# EAGLE design 555-ADSR-Rene-Schmitz (EAGLE 7.2.0)
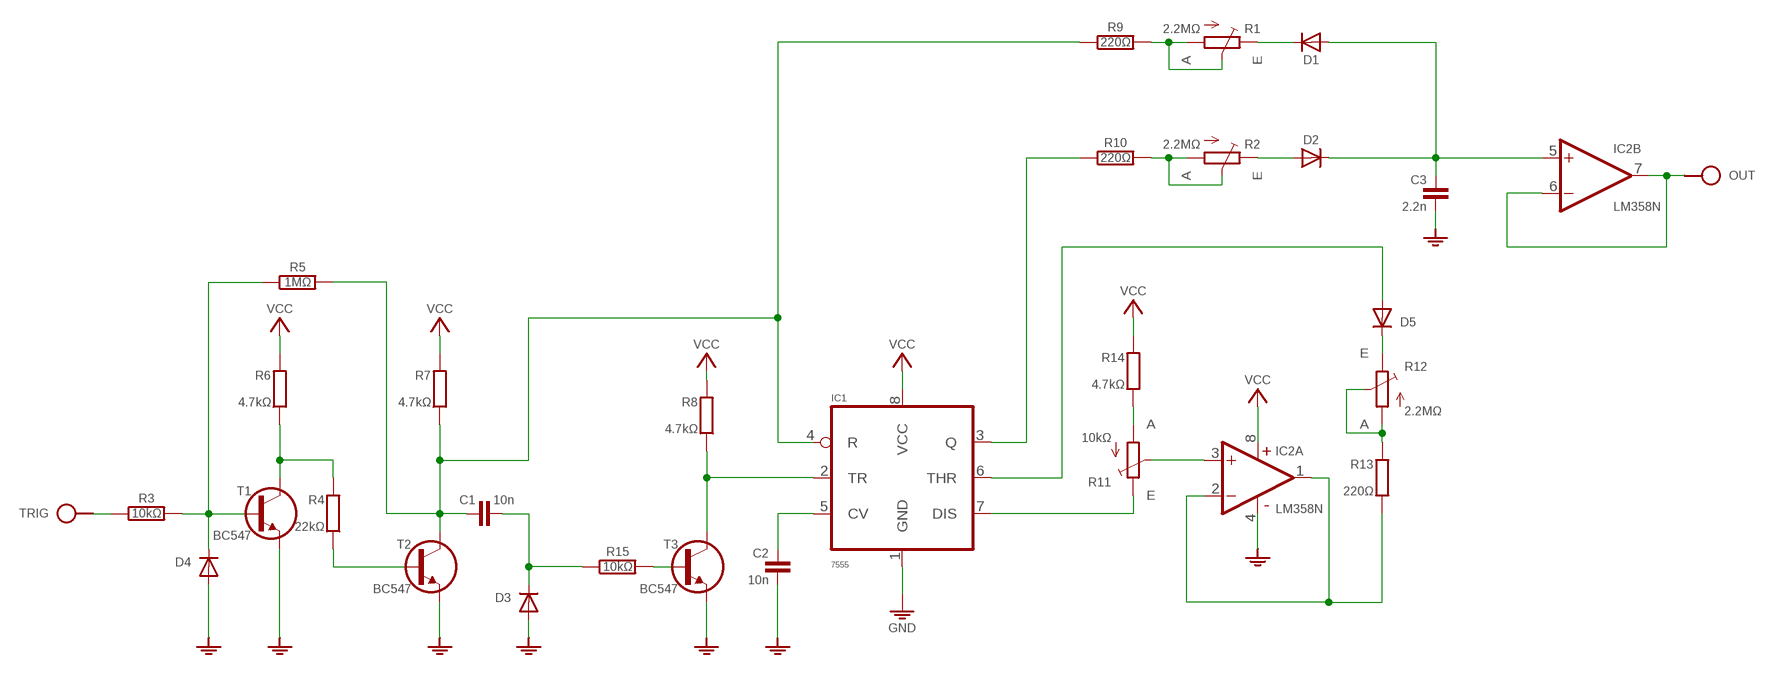
[diagram p0: schematic, sheet 1]

## Parts
C1  10n  C-H050-020X044  [C050-020X044]
C2  10n  C050-025X075/V  [C050-025X075/V]
C3  2.2n  C050-025X075/V  [C050-025X075/V]
D1  DIODE-HDO34-7  [DO34-7]
D2  DIODE-HDO34-7  [DO34-7]
D3  DIODE34-7V  [DO34-7V]
D4  DIODE34-7V  [DO34-7V]
D5  DIODE34-7V  [DO34-7V]
IC1  7555  [DIL08]
IC2  LM358N  [DIL08]
OUT  SPAD  [SPAD]
R1  2.2MΩ  TRIMR-TRIM  [R-TRIM]
R2  2.2MΩ  TRIMR-TRIM  [R-TRIM]
R3  10kΩ  R-H0204/10  [0204/10]
R4  22kΩ  R0204/10-V  [0204/10-V]
R5  1MΩ  R-H0204/10  [0204/10]
R6  4.7kΩ  R0204/10  [0204/10]
R7  4.7kΩ  R0204/10  [0204/10]
R8  4.7kΩ  R0204/10  [0204/10]
R9  220Ω  R-H0204/10  [0204/10]
R10  220Ω  R-H0204/10  [0204/10]
R11  10kΩ  TRIMR-TRIM  [R-TRIM]
R12  2.2MΩ  TRIMR-TRIM  [R-TRIM]
R13  220Ω  R0204/10-V  [0204/10-V]
R14  4.7kΩ  R0204/10  [0204/10]
R15  10kΩ  R-H0204/10  [0204/10]
S2  VCC_GNDL  [SPAD-+]
T1  BC547  [TO92-CBE]
T2  BC547  [TO92-CBE]
T3  BC547  [TO92-CBE]
TRIG  SPAD  [SPAD]

## Nets
GND: C2.2 C3.2 D3.A D4.A IC1.1(GND) IC2.4(P:V-) S2.1 T1.E T2.E T3.E
N$1: R4.1 R6.2 T1.C
N$2: R4.2 T2.B
N$3: IC2.3(A:+IN) R11.2(S)
N$4: D4.C R3.2 R5.1 T1.B
N$5: R15.2 T3.B
N$6: R1.1(A) R1.2(S) R9.2
N$7: R2.1(A) R2.2(S) R10.2
N$8: R3.1 TRIG.1
N$9: C1.1 IC1.4(R) R5.2 R7.2 R9.1 T2.C
N$10: IC1.2(TR) R8.2 T3.C
N$11: IC2.6(B:-IN) IC2.7(B:OUT) OUT.1
N$12: C2.1 IC1.5(CV)
N$13: R12.1(A) R12.2(S) R13.1
N$14: R11.1(A) R14.2
N$15: IC1.7(DIS) R11.3(E)
N$16: D5.A IC1.6(THR)
N$17: D5.C R12.3(E)
N$18: C1.2 D3.C R15.1
N$19: IC1.3(Q) R10.1
N$20: D2.A R2.3(E)
N$21: D1.C R1.3(E)
N$22: IC2.1(A:OUT) IC2.2(A:-IN) R13.2
N$23: C3.1 D1.A D2.C IC2.5(B:+IN)
VCC: IC1.8(VCC) IC2.8(P:V+) R6.1 R7.1 R8.1 R14.1 S2.2

## Library data of the parts
C1 = c:C-H
C2 C3 = c:C: CAPACITOR, European symbol
D1 D2 = d:DIODE-H
D3-D5 = d:DIODE
IC1 = ic:7555
IC2 = ic:LM358: OP AMP also LM158; LM258; LM2904 Source: http://cache.national.com/ds/LM/LM158.pdf
OUT TRIG = pad:SPAD
R1 R2 R11 R12 = r:TRIM: POTENTIOMETER
R3 R5 R9 R10 R15 = r:R-H
R4 R6-R8 R13 R14 = r:R: RESISTOR, European symbol
S2 = pad:VCC_GND
T1-T3 = t:BC547

## Net classes
0 default: width 1.27 mm

## Board
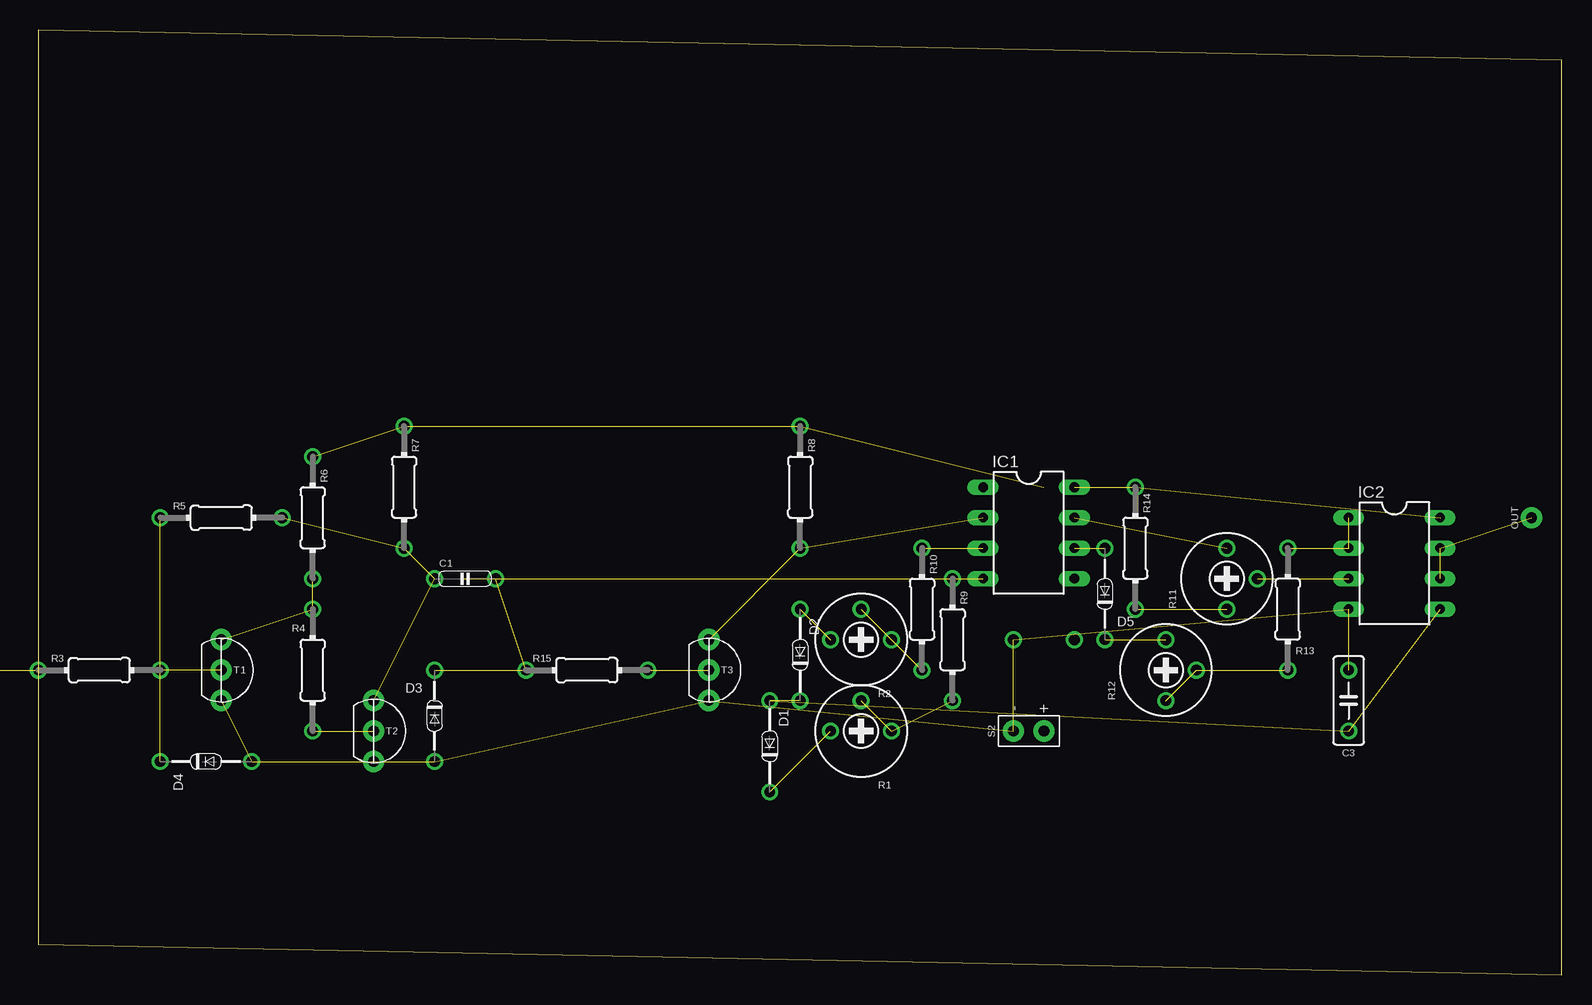
[diagram p1: board, top side]
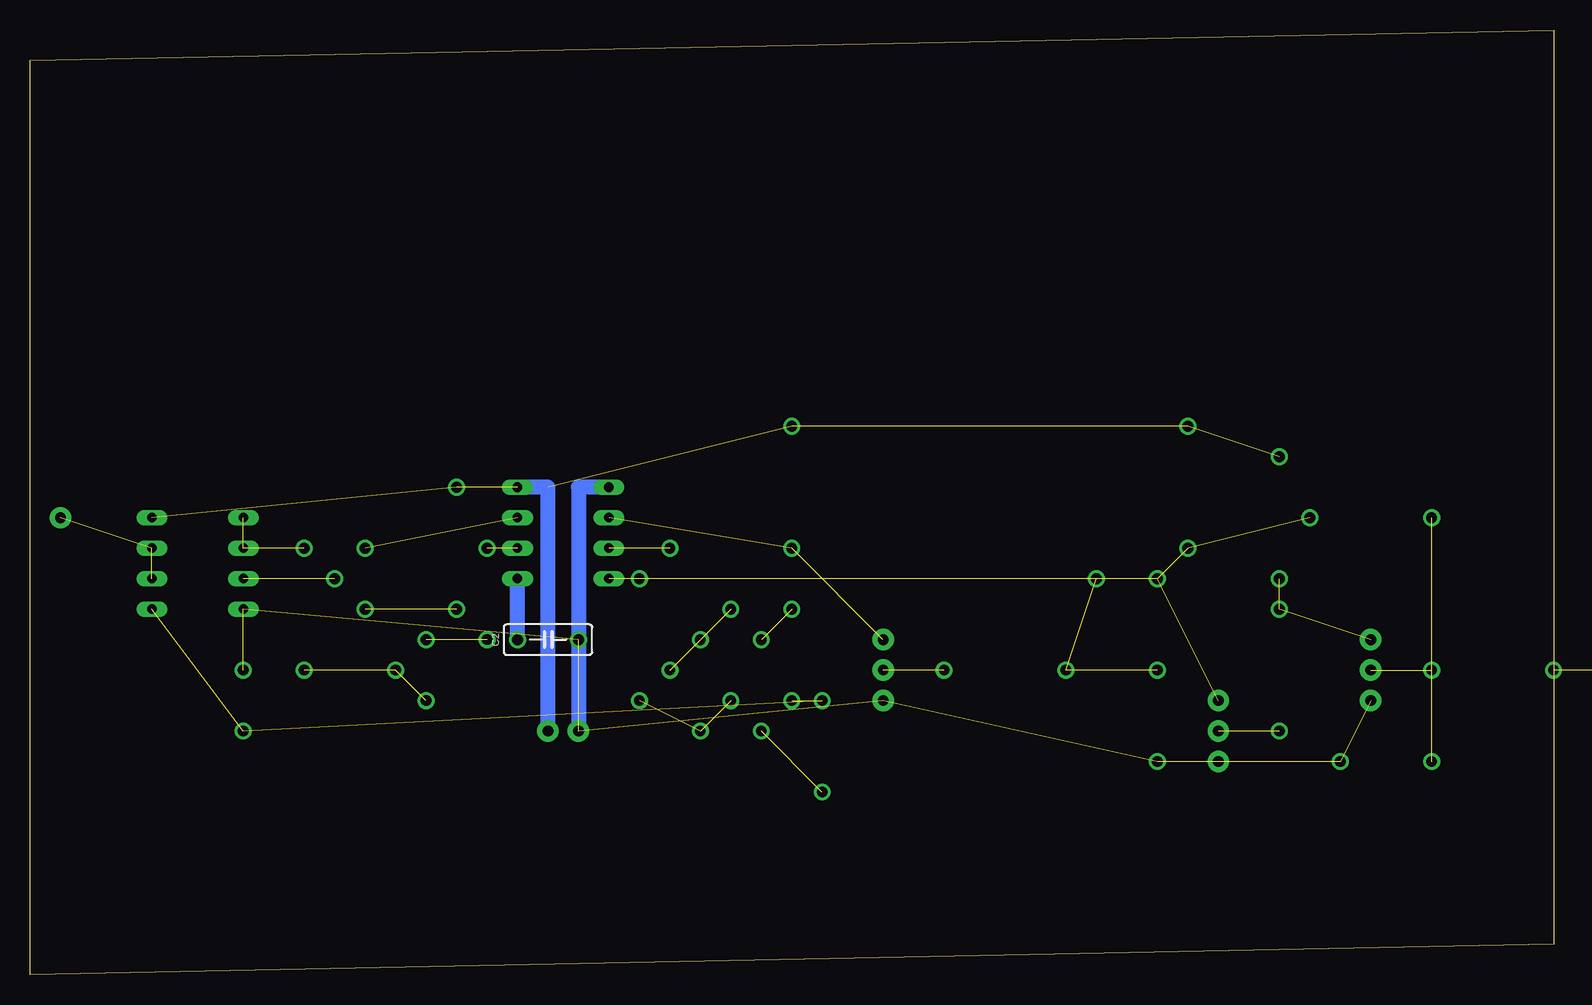
[diagram p2: board, bottom side, seen from below]

Size 127 x 78.74 mm. Coordinates in mm from the lower left corner, seen from the top.
Outline: 0,2.54 127,0 127,76.2 0,78.74 0,2.54
Copper layers (1*16): Top 0.035mm / dielectric 1.5mm / Bottom 0.035mm
Design rules "default": minimum track width 10mil, minimum drill 24mil, track to track 8mil, track to pad 8mil, pad to pad 8mil, via to via 8mil, smd to smd 8mil, copper to edge 40mil, drill to drill 8mil, minimum pad ring 10mil, minimum via ring 8mil, stop-mask expansion 4mil, vias tented up to drill 0mil, thermal gap 10mil

### Footprints (pad centres in the part's own frame; a part is rotated, then mirrored left to right if it is on the bottom)
C050-020X044 = drill 0.9: 1 -2.54,0; 2 2.54,0
C050-025X075/V = drill 0.9: 1 0,2.54; 2 0,-2.54
DO34-7 = drill 0.9: A 3.81,0; C -3.81,0
DO34-7V = drill 0.9: A 0,-3.81; C 0,3.81
DIL08 = drill 0.8 pad 1.27 long: 1 -3.81,3.81; 2 -3.81,1.27; 3 -3.81,-1.27; 4 -3.81,-3.81; 5 3.81,-3.81; 6 3.81,-1.27; 7 3.81,1.27; 8 3.81,3.81
SPAD = drill 0.9 pad 1.778: 1 0,0
R-TRIM = drill 0.9: 1 -2.54,0; 2 0,-2.54; 3 2.54,0
0204/10 = drill 0.9: 1 -5.08,0; 2 5.08,0
0204/10-V = drill 0.9: 1 0,5.08; 2 0,-5.08
SPAD-+ = drill 0.9 pad 1.778: 1 0,-1.27; 2 0,1.27
TO92-CBE = drill 0.9 pad 1.778: B 0,0; C 0,2.54; E 0,-2.54

### Placement (x,y rotation side)
C1  35.56,33.02 0 top
C2  83.82,27.94 90 bottom
C3  109.22,22.86 180 top
D1  60.96,19.05 90 top
D2  63.5,26.67 90 top
D3  33.02,21.59 0 top
D4  13.97,17.78 90 top
D5  88.9,31.75 180 top
IC1  82.55,36.83 0 top
IC2  113.03,34.29 0 top
OUT  124.46,38.1 0 top
R1  68.58,20.32 180 top
R2  68.58,27.94 180 top
R3  5.08,25.4 0 top
R4  22.86,25.4 0 top
R5  15.24,38.1 0 top
R6  22.86,38.1 270 top
R7  30.48,40.64 270 top
R8  63.5,40.64 270 top
R9  76.2,27.94 270 top
R10  73.66,30.48 270 top
R11  99.06,33.02 90 top
R12  93.98,25.4 90 top
R13  104.14,30.48 180 top
R14  91.44,35.56 270 top
R15  45.72,25.4 0 top
S2  82.55,20.32 270 top
T1  15.24,25.4 0 top
T2  27.94,20.32 0 top
T3  55.88,25.4 0 top
TRIG  -12.7,25.4 0 top  (outside the outline)

### Tracks (layer width: path | path; a pad name or v marks a point on that pad's centre or on a via)
GND  (8 unrouted)
  Bottom 1.27: IC1.1 81.28,40.64 S2.1
N$1  (2 unrouted)
N$2  (1 unrouted)
N$3  (1 unrouted)
N$4  (3 unrouted)
N$5  (1 unrouted)
N$6  (2 unrouted)
N$7  (2 unrouted)
N$8  (1 unrouted)
N$9  (5 unrouted)
N$10  (2 unrouted)
N$11  (2 unrouted)
N$12
  Bottom 1.27: C2.1 IC1.5
N$13  (2 unrouted)
N$14  (1 unrouted)
N$15  (1 unrouted)
N$16  (1 unrouted)
N$17  (1 unrouted)
N$18  (2 unrouted)
N$19  (1 unrouted)
N$20  (1 unrouted)
N$21  (1 unrouted)
N$22  (2 unrouted)
N$23  (3 unrouted)
VCC  (5 unrouted)
  Bottom 1.27: S2.2 83.82,40.64 IC1.8